# Altium schematic sheet STRWHL-S02-V00-Microcontroller.SchDoc: Microcontroller
size A3; DrawnBy: Jonn DIllon; DocumentNumber: 2; Revision: 00; SheetNumber: 2; SheetTotal: 9; Project: Steering Wheel 2020; PageSetup: Record=PageOptions|CenterHorizontal=True|CenterVertical=True|PrintScale=0.97|XCorrection=1.00|YCorrection=1.00|PrintKind=0|BorderSize=5000000|LeftOffset=0|BottomOffset=0|Orientation=2|PaperLength=1000|PaperWidth=1000|Scale=100|PaperSource=7|PrintQuality=-4|MediaType=1|DitherType=10|PaperKind=A4|PrintScaleMode=1
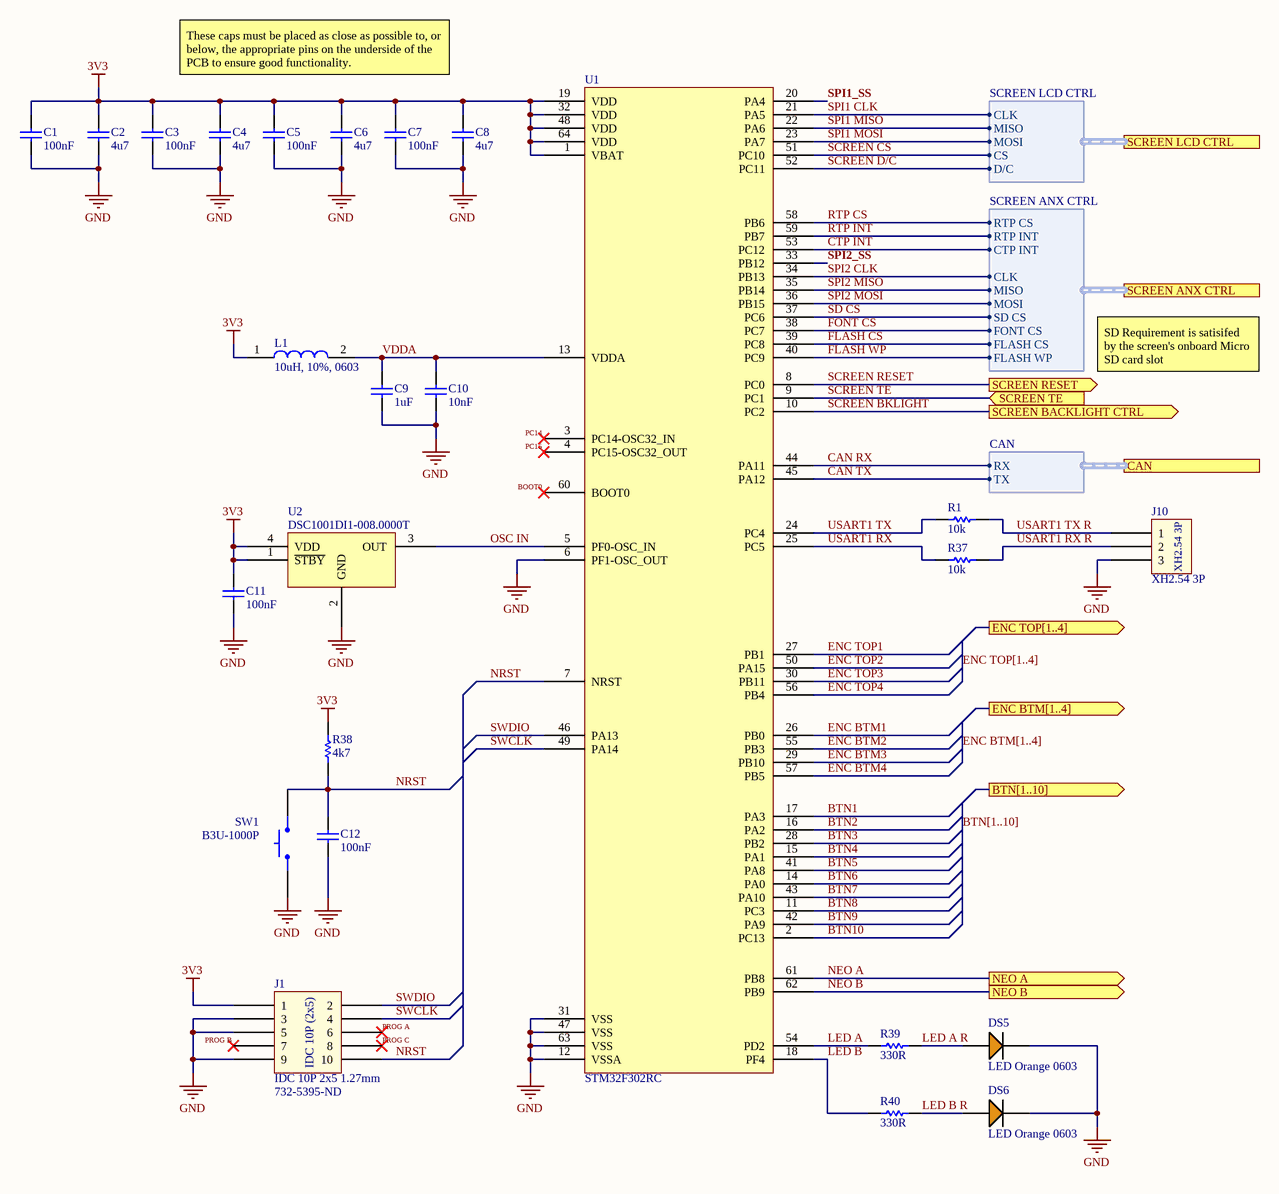
[diagram p0: STRWHL-S02-V00-Microcontroller.SchDoc]

## Parts
C1  100nF  [Cap_Ceramic_0603]
C2  4u7  [Cap_Ceramic_0603]
C3  100nF  [Cap_Ceramic_0603]
C4  4u7  [Cap_Ceramic_0603]
C5  100nF  [Cap_Ceramic_0603]
C6  4u7  [Cap_Ceramic_0603]
C7  100nF  [Cap_Ceramic_0603]
C8  4u7  [Cap_Ceramic_0603]
C9  1uF  [Cap_Ceramic_0603]
C10  10nF  [Cap_Ceramic_0603]
C11  100nF  [Cap_Ceramic_0603]
C12  100nF  [Cap_Ceramic_0603]
DS5  LED Orange 0603  [LED ORANGE 0603]
DS6  LED Orange 0603  [LED ORANGE 0603]
J1  IDC 10P 2x5 1.27mm  [IDC 1.27MM 10P]
J10  XH2.54 3P  [JST_XH254_3P_TH_RH]
L1  10uH, 10%, 0603  [Inductor_0603]
R1  10k  [Res_ThinFilm_0603]
R37  10k  [Res_ThinFilm_0603]
R38  4k7  [Res_ThinFilm_0603]
R39  330R  [Res_ThinFilm_0603]
R40  330R  [Res_ThinFilm_0603]
SW1  B3U-1000P  [BTN B3U-1000P]
U1  STM32F302RC  [STM32F302RC]
U2  DSC1001DI1-008.0000T  [DSC1001DI1-008.0000TCT-ND]

## Ports
BTN[1..10] (out), CAN (harness CAN), ENC BTM[1..4] (out), ENC TOP[1..4] (out), NEO A (out), NEO B (out), SCREEN ANX CTRL (harness SCREEN ANX CTRL), SCREEN BACKLIGHT CTRL (out), SCREEN LCD CTRL (harness SCREEN LCD CTRL), SCREEN RESET (out), SCREEN TE (in)

## Harnesses
CAN: RX, TX
SCREEN LCD CTRL: CLK, MOSI, MISO, CS, D/C
SCREEN ANX CTRL: CLK, MISO, MOSI, RTP CS, RTP INT, CTP INT, SD CS, FONT CS, FLASH CS, FLASH WP

## Nets
3V3: C1.2 C2.2 C3.2 C4.2 C5.2 C6.2 C7.2 C8.2 C11.2 J1.1 L1.1 R38.2 U1.1(VBAT) U1.19(VDD) U1.32(VDD) U1.48(VDD) U1.64(VDD) U2.1(~{STBY}) U2.4(VDD)
GND: C1.1 C2.1 C3.1 C4.1 C5.1 C6.1 C7.1 C8.1 C9.1 C10.1 C11.1 C12.1 DS5.2(C) DS6.2(C) J1.3 J1.5 J1.9 J10.3 SW1.1 U1.6(PF1-OSC_OUT) U1.12(VSSA) U1.31(VSS) U1.47(VSS) U1.63(VSS) U2.2(GND)
BOOT0: U1.60(BOOT0)
BTN1: U1.17(PA3)
BTN2: U1.16(PA2)
BTN3: U1.28(PB2)
BTN4: U1.15(PA1)
BTN5: U1.41(PA8)
BTN6: U1.14(PA0)
BTN7: U1.43(PA10)
BTN8: U1.11(PC3)
BTN9: U1.42(PA9)
BTN10: U1.2(PC13)
CAN RX: U1.44(PA11) ; port CAN.RX
CAN TX: U1.45(PA12) ; port CAN.TX
CTP INT: U1.53(PC12) ; port SCREEN ANX CTRL.CTP INT
ENC BTM1: U1.26(PB0)
ENC BTM2: U1.55(PB3)
ENC BTM3: U1.29(PB10)
ENC BTM4: U1.57(PB5)
ENC TOP1: U1.27(PB1)
ENC TOP2: U1.50(PA15)
ENC TOP3: U1.30(PB11)
ENC TOP4: U1.56(PB4)
FLASH CS: U1.39(PC8) ; port SCREEN ANX CTRL.FLASH CS
FLASH WP: U1.40(PC9) ; port SCREEN ANX CTRL.FLASH WP
FONT CS: U1.38(PC7) ; port SCREEN ANX CTRL.FONT CS
LED A: R39.1 U1.54(PD2)
LED A R: DS5.1(A) R39.2
LED B: R40.1 U1.18(PF4)
LED B R: DS6.1(A) R40.2
NEO A: U1.61(PB8) ; port NEO A
NEO B: U1.62(PB9) ; port NEO B
NRST: C12.2 J1.10 R38.1 SW1.2 U1.7(NRST)
OSC IN: U1.5(PF0-OSC_IN) U2.3(OUT)
PC14: U1.3(PC14-OSC32_IN)
PC15: U1.4(PC15-OSC32_OUT)
PROG A: J1.6
PROG B: J1.7
PROG C: J1.8
RTP CS: U1.58(PB6) ; port SCREEN ANX CTRL.RTP CS
RTP INT: U1.59(PB7) ; port SCREEN ANX CTRL.RTP INT
SCREEN BKLIGHT: U1.10(PC2) ; port SCREEN BACKLIGHT CTRL
SCREEN CS: U1.51(PC10) ; port SCREEN LCD CTRL.CS
SCREEN D/C: U1.52(PC11) ; port SCREEN LCD CTRL.D/C
SCREEN RESET: U1.8(PC0) ; port SCREEN RESET
SCREEN TE: U1.9(PC1) ; port SCREEN TE
SD CS: U1.37(PC6) ; port SCREEN ANX CTRL.SD CS
SPI1 CLK: U1.21(PA5) ; port SCREEN LCD CTRL.CLK
SPI1 MISO: U1.22(PA6) ; port SCREEN LCD CTRL.MISO
SPI1 MOSI: U1.23(PA7) ; port SCREEN LCD CTRL.MOSI
SPI1_SS: U1.20(PA4)
SPI2 CLK: U1.34(PB13) ; port SCREEN ANX CTRL.CLK
SPI2 MISO: U1.35(PB14) ; port SCREEN ANX CTRL.MISO
SPI2 MOSI: U1.36(PB15) ; port SCREEN ANX CTRL.MOSI
SPI2_SS: U1.33(PB12)
SWCLK: J1.4 U1.49(PA14)
SWDIO: J1.2 U1.46(PA13)
USART1 RX: R37.1 U1.25(PC5)
USART1 RX R: J10.2 R37.2
USART1 TX: R1.1 U1.24(PC4)
USART1 TX R: J10.1 R1.2
VDDA: C9.2 C10.2 L1.2 U1.13(VDDA)

## Buses and harness runs
bus BTN[1..10] = port BTN[1..10]
bus ENC BTM[1..4] = port ENC BTM[1..4]
bus ENC TOP[1..4] = port ENC TOP[1..4]

## Notes on the sheet
- These caps must be placed as close as possible to, or below, the appropriate pins on the underside of the PCB to ensure good functionality.
- SD Requirement is satisifed by the screen's onboard Micro SD card slot
- (near J1) 732-5395-ND
- Revision History:
- Sheet Title:
- Rev
- Date
- Description
- Project:
- Size:
- Drawn By:
- A3
- Number:
- Revision:
- Sheet
- Version:
- of
- QUT Motorsport
- O-120, Gardens Point
- 2 George Street
- Brisbane, QLD 4000
- Australia
- Print Date:
- Print Time:
- File Name:
- (in symbol IDC 10P 2x5 1.27mm) IDC 10P (2x5)

## Library data of the parts
C1 C3 C5 C7 C11 C12 = 100nF 50V 5% X7R 0603: Capacitor, Ceramic, SMD, 100nF, 50V, 5%, X7R, 0603
C2 C4 C6 C8 = 4u7 50V 5% X7R 0603: Capacitor, Ceramic, SMD, 4u7, 50V, 5%, X7R, 0603
C9 = 1uF 25V 5% X7R 0603: Capacitor, Ceramic, SMD, 1uF, 25V, 5%, X7R, 0603
C10 = 10nF 50V 5% X7R 0603: Capacitor, Ceramic, SMD, 10nF, 50V, 5%, X7R, 0603
R1 R37 = 10k 5% 0603: Resistor, SMD, 10k, 0.1W, 5%, 0603
R38 = 4k7 5% 0603: Resistor, SMD, 4k7, 0.1W, 5%, 0603
R39 R40 = 330R 5% 0603: Resistor, SMD, 330R, 0.1W, 5%, 0603
SW1 = BTN B3U-1000P: Omron B3U-1000P Ultra Miniture Switch; ComponentLink1Description: LCSC; ComponentLink1URL: https://lcsc.com/product-detail/Tactile-Switches_BRIGHT-TSA063G50-250_C294565.html
U1 = STM32F302RC: ARM® Cortex®-M4 STM32F3 Microcontroller IC 32-Bit 72MHz 256KB (256K x 8) FLASH 64-LQFP (10x10); ComponentLink1Description: Digikey; ComponentLink1URL: https://www.digikey.com.au/product-detail/en/stmicroelectronics/STM32F302RCT6TR/497-19000-1-ND/9974332; ComponentLink2Description: Datasheet; ComponentLink2URL: http://www.st.com/content/ccc/resource/technical/document/datasheet/67/73/21/b9/f2/b3/4d/f8/DM00094064.pdf/files/DM00094064.pdf/jcr:content/translations/en.DM00094064.pdf
U2 = DSC1001DI1-008.0000T: on 8MHz XO (Standard) CMOS Oscillator 1.8 ~ 3.3V Standby (Power Down) 4-SMD, No Lead
L1 = 10uH, 10%, 0603: ComponentLink1Description: Digikey; ComponentLink1URL: https://www.digikey.com.au/product-detail/en/w%C3%BCrth-elektronik/74404064221/732-7261-1-ND/5353241; ComponentLink2Description: LCSC A; ComponentLink2URL: https://lcsc.com/product-detail/Power-Inductors_Sunlord-SWPA6045S221MT_C91047.html; ComponentLink3Description: LCSC B; ComponentLink3URL: https://lcsc.com/product-detail/Power-Inductors_SXN-Shun-Xiang-Nuo-Elec-SMNR6045-221MT_C467145.html